# EAGLE design MQTT Monitor v2 (EAGLE 7.7.0)
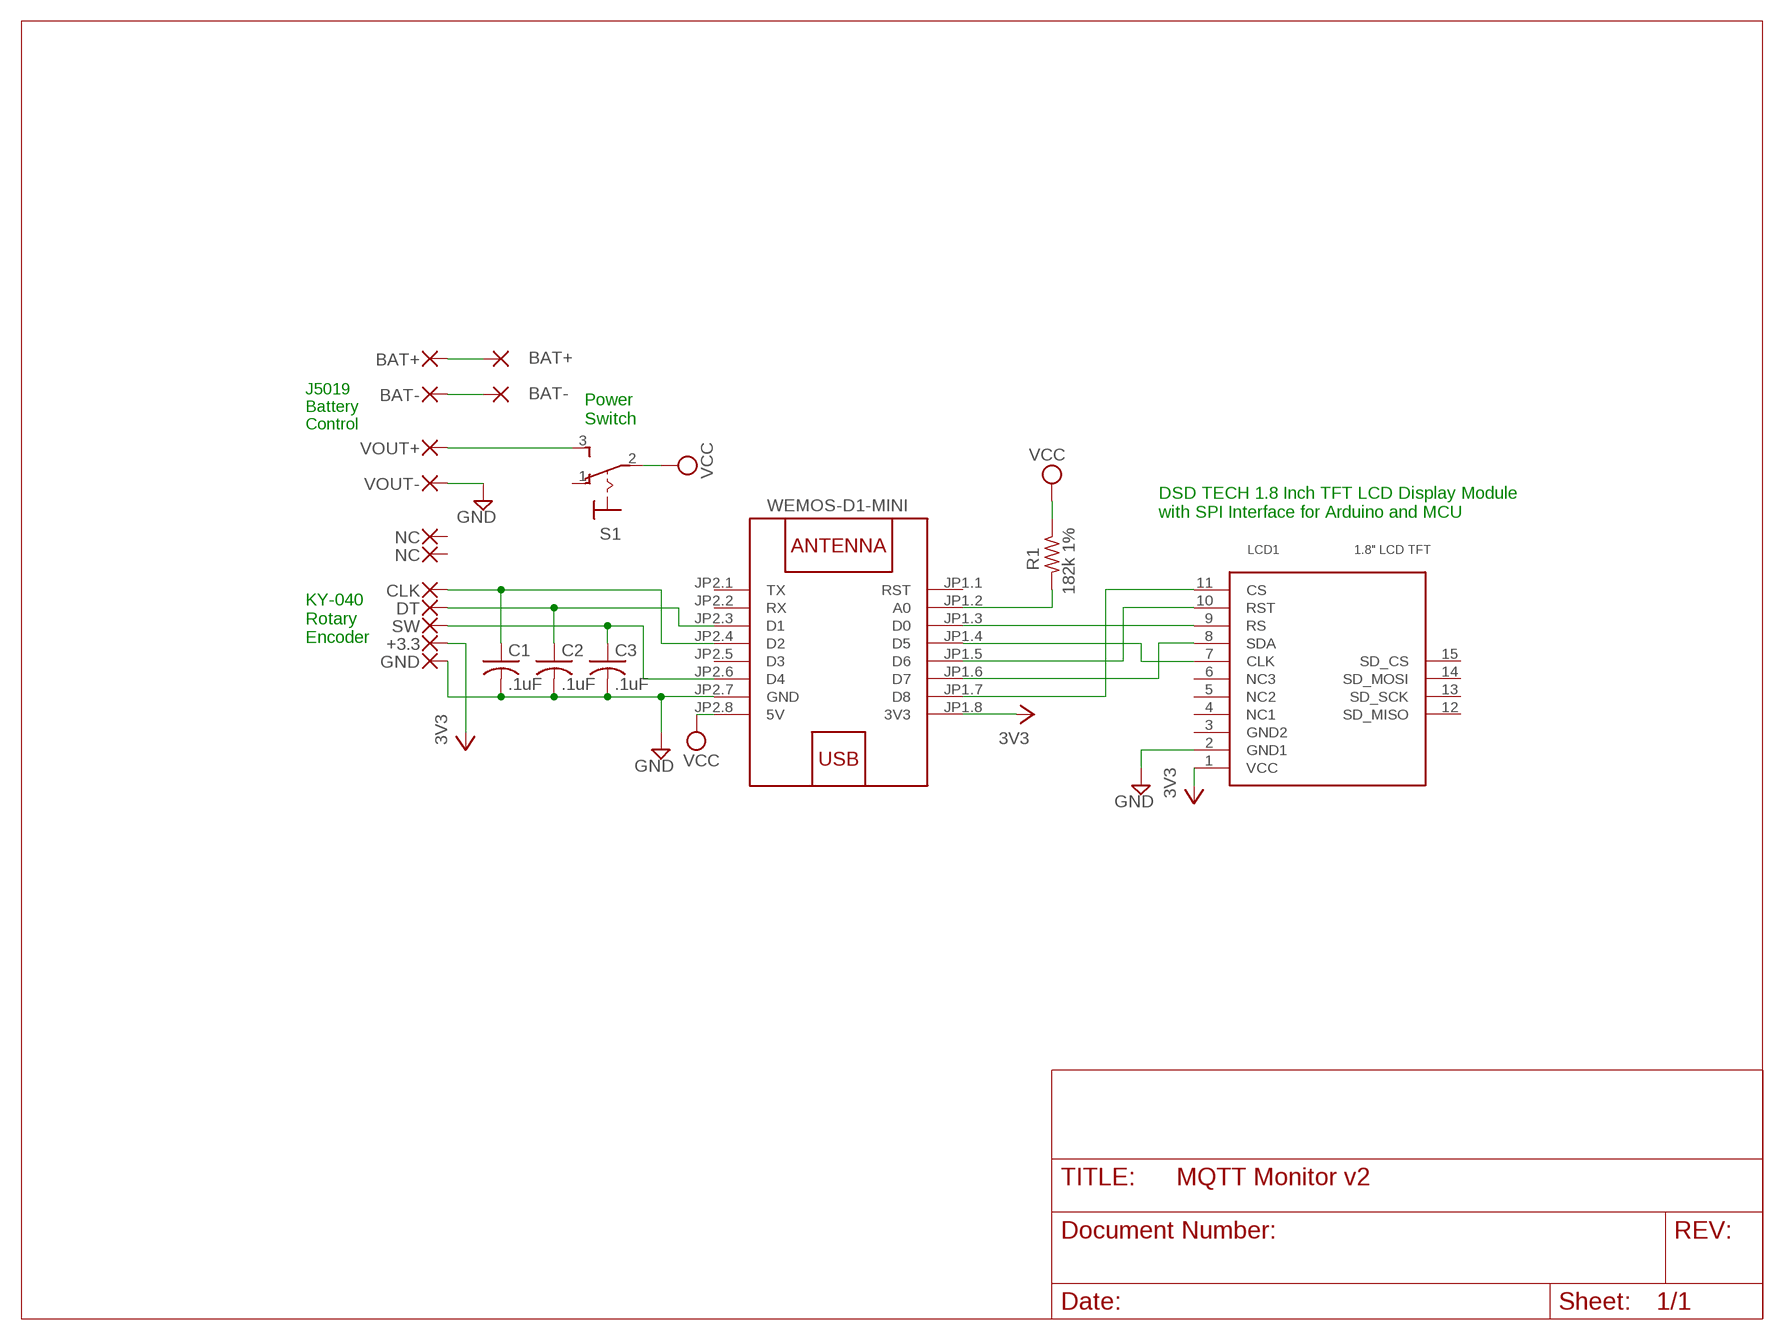
[diagram p0: schematic, sheet 1]

## Parts
C1  .1uF  C-USC1206  [C1206]
C2  .1uF  C-USC1206  [C1206]
C3  .1uF  C-USC1206  [C1206]
LCD1  1.8" LCD TFT  DSDTECH1.8"TFT  [DSDTECH1.8"TFT]
PAD1  CLK  2,15/1,0  [2,15/1,0]
PAD2  DT  2,15/1,0  [2,15/1,0]
PAD3  SW  2,15/1,0  [2,15/1,0]
PAD4  +3.3  2,15/1,0  [2,15/1,0]
PAD5  GND  2,15/1,0  [2,15/1,0]
PAD6  VOUT+  2,15/1,0  [2,15/1,0]
PAD7  VOUT-  2,15/1,0  [2,15/1,0]
PAD8  BAT+  2,15/1,0  [2,15/1,0]
PAD9  BAT-  2,15/1,0  [2,15/1,0]
PAD10  BAT+  2,15/1,0  [2,15/1,0]
PAD11  BAT-  2,15/1,0  [2,15/1,0]
PAD12  NC  2,15/1,0  [2,15/1,0]
PAD13  NC  2,15/1,0  [2,15/1,0]
R1  182k 1%  R-US_R1206  [R1206]
S1  320-916  [320-916]
U$1  WEMOS-D1-MINI  [WEMOS-D1-MINI]

## Nets
3V3: LCD1.1(VCC) PAD4.1(P) U$1.JP1.8(3V3)
5V: R1.1 S1.2(P) U$1.JP2.8(5V) ; supply symbol labelled VCC
GND: C1.2 C2.2 C3.2 LCD1.2(GND1) PAD5.1(P) PAD7.1(P) U$1.JP2.7(GND)
N$1: R1.2 U$1.JP1.2(A0)
N$2: C3.1 PAD3.1(P) U$1.JP2.6(D4)
N$3: LCD1.7(CLK) U$1.JP1.4(D5)
N$4: LCD1.8(SDA) U$1.JP1.6(D7)
N$5: LCD1.9(RS) U$1.JP1.3(D0)
N$6: LCD1.10(RST) U$1.JP1.5(D6)
N$7: LCD1.11(CS) U$1.JP1.7(D8)
N$8: PAD8.1(P) PAD10.1(P)
N$9: PAD9.1(P) PAD11.1(P)
N$10: C2.1 PAD2.1(P) U$1.JP2.3(D1)
N$11: C1.1 PAD1.1(P) U$1.JP2.4(D2)
N$12: PAD6.1(P) S1.3(S)
Unconnected: LCD1.3(GND2) LCD1.4(NC1) LCD1.5(NC2) LCD1.6(NC3) LCD1.12(SD_MISO) LCD1.13(SD_SCK) LCD1.14(SD_MOSI) LCD1.15(SD_CS) PAD12.1(P) PAD13.1(P) S1.1(O) U$1.JP1.1(RST) U$1.JP2.1(TX) U$1.JP2.2(RX) U$1.JP2.5(D3)

## Notes on the sheet
- Power
  Switch
- J5019
  Battery
  Control
- DSD TECH 1.8 Inch TFT LCD Display Module
  with SPI Interface for Arduino and MCU
- KY-040
  Rotary
  Encoder

## Library data of the parts
C1-C3 = rcl:C-US: CAPACITOR, American symbol
LCD1 = tft_1.8_1.44_oled_0.96:DSDTECH1.8"TFT
PAD1-PAD13 = wirepad:2,15/1,0: THROUGH-HOLE PAD
R1 = rcl:R-US_: RESISTOR, American symbol
S1 = switch:320-916: TOGGLE SWITCH distributor RS Components
U$1 = diy-modules:WEMOS-D1-MINI: WEMOS D1 mini: Mini Wi-Fi Board based on ESP-8266 device More details can be found here: https://www.wemos.cc/product/d1-mini.html Click here to find device on ebay.com <http://www.ebay.com/sch/wemos+d1+mini+nodemcu>

## Board
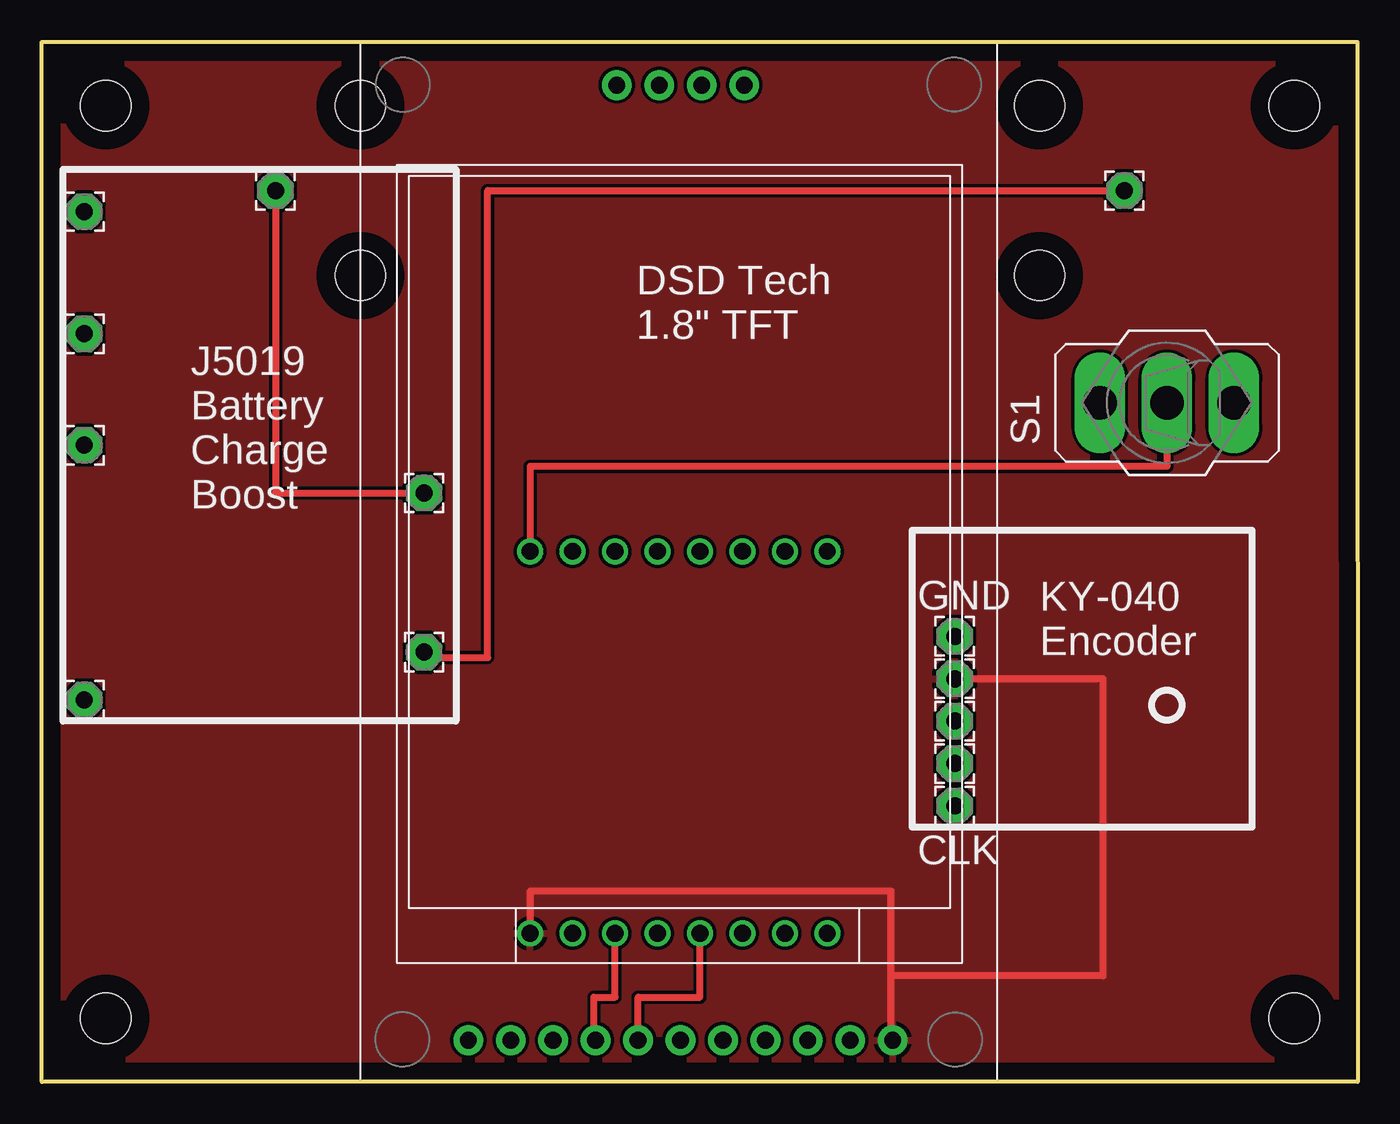
[diagram p1: board, top side]
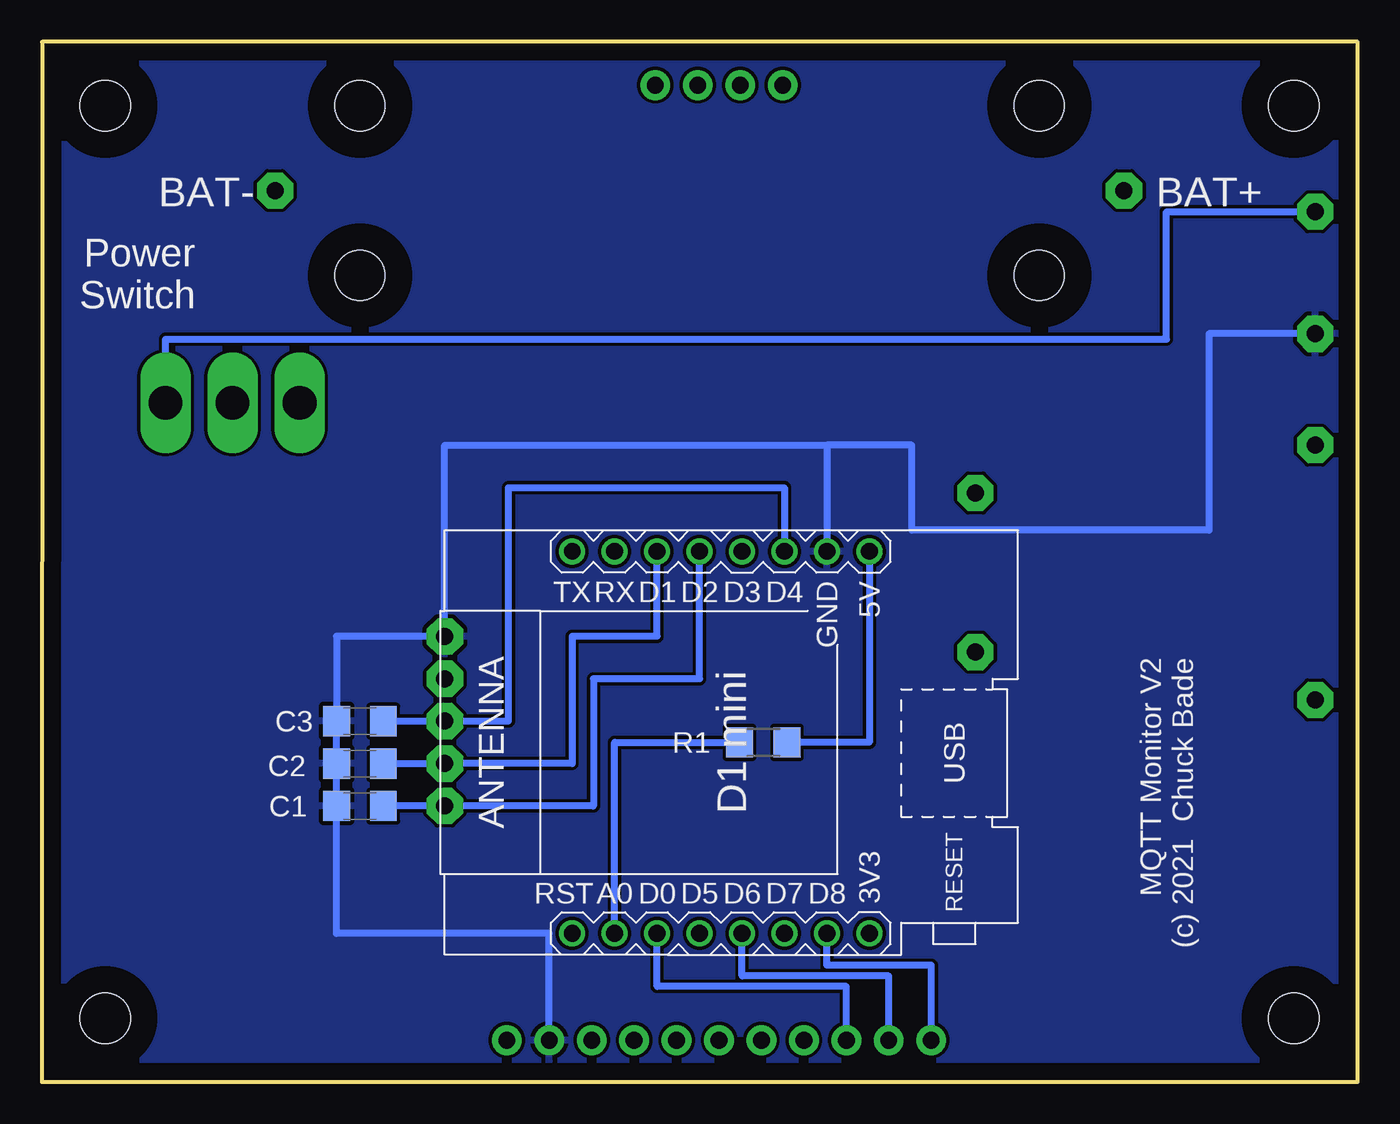
[diagram p2: board, bottom side, seen from below]

Size 78.74 x 62.24 mm. Coordinates in mm from the lower left corner, seen from the top.
Outline: 0.01,62.23 78.71,62.24 78.74,0 0,0 0.01,62.23
Copper layers (1*16): Top 0.035mm / dielectric 1.5mm / Bottom 0.035mm
Design rules "default *": minimum track width 10mil, minimum drill 10mil, track to track 8mil, track to pad 8mil, pad to pad 8mil, via to via 8mil, smd to smd 8mil, copper to edge 40mil, drill to drill 8mil, minimum pad ring 11mil, minimum via ring 8mil, stop-mask expansion 4mil, vias tented up to drill 0mil, thermal gap 10mil

### Footprints (pad centres in the part's own frame; a part is rotated, then mirrored left to right if it is on the bottom)
C1206 = smd 1.6 x 1.8: 1 -1.4,0; 2 1.4,0
DSDTECH1.8"TFT = drill 1 pad 1.778: 1 2.5,6.245; 2 2.5,8.785; 3 2.5,11.325; 4 2.5,13.865; 5 2.5,16.405; 6 2.5,18.945; 7 2.5,21.485; 8 2.5,24.025; 9 2.5,26.565; 10 2.5,29.105; 11 2.5,31.645; 12 59.65,15.135; 13 59.65,17.675; 14 59.65,20.215; 15 59.65,22.755
2,15/1,0 = drill 1.016 pad 2.159 octagon: 1 0,0
R1206 = smd 1.6 x 1.803: 1 -1.422,0; 2 1.422,0
320-916 = drill 2.007 long: 1 0,4.013; 2 0,0; 3 0,-4.013
WEMOS-D1-MINI = drill 1: JP1.1 -11.43,9.525; JP1.2 -11.43,6.985; JP1.3 -11.43,4.445; JP1.4 -11.43,1.905; JP1.5 -11.43,-0.635; JP1.6 -11.43,-3.175; JP1.7 -11.43,-5.715; JP1.8 -11.43,-8.255; JP2.1 11.43,9.525; JP2.2 11.43,6.985; JP2.3 11.43,4.445; JP2.4 11.43,1.905; JP2.5 11.43,-0.635; JP2.6 11.43,-3.175; JP2.7 11.43,-5.715; JP2.8 11.43,-8.255
4-40SCREW = hole 2.997: 0,0

### Placement (x,y rotation side)
C1  59.7,16.51 180 bottom
C2  59.7,19.05 180 bottom
C3  59.7,21.59 180 bottom
LCD1  57.16,0 90 top
PAD1  54.62,16.51 0 top
PAD2  54.62,19.05 0 top
PAD3  54.62,21.59 0 top
PAD4  54.62,24.13 0 top
PAD5  54.62,26.67 0 top
PAD6  2.55,52.07 0 top
PAD7  2.55,44.76 0 top
PAD8  22.87,35.24 0 top
PAD9  22.87,25.71 0 top
PAD10  13.98,53.34 0 top
PAD11  64.78,53.34 0 top
PAD12  2.55,38.1 0 top
PAD13  2.55,22.86 0 top
R1  35.57,20.32 180 bottom
S1  67.32,40.64 90 top
U$1  37.48,20.32 90 bottom
U$3  [4-40SCREW]  3.82,58.42 180 bottom
U$4  [4-40SCREW]  74.94,3.81 180 bottom
U$5  [4-40SCREW]  74.94,58.42 180 bottom
U$6  [4-40SCREW]  3.82,3.81 180 bottom
U$7  [4-40SCREW]  19.06,58.42 180 bottom
U$8  [4-40SCREW]  59.7,58.42 180 bottom
U$9  [4-40SCREW]  59.7,48.26 180 bottom
U$10  [4-40SCREW]  19.06,48.26 180 bottom

### Tracks (layer width: path | path; a pad name or v marks a point on that pad's centre or on a via)
3V3
  Top 0.406: LCD1.1 50.81,2.6 50.81,6.35 | 50.81,6.35 50.81,11.43 29.22,11.43 U$1.JP1.8 | 50.81,6.35 63.51,6.35 63.51,24.13 PAD4.1
  pour Top: -2.53,64.77 81.29,64.77 81.29,-2.54 -2.53,-2.54
5V
  Top 0.406: S1.2 67.32,36.83 29.22,36.83 U$1.JP2.8
  Bottom 0.406: U$1.JP2.8 29.22,20.32 R1.1
GND
  Bottom 0.406: LCD1.2 48.38,8.89 61.1,8.89 C1.2 C2.2 C3.2 61.1,26.67 PAD5.1 54.62,38.1 31.76,38.1 | 31.76,38.1 U$1.JP2.7 | PAD7.1 8.9,44.76 8.9,33.02 26.68,33.02 26.68,38.1 31.76,38.1
  pour Bottom: -1.26,63.5 80.02,63.5 80.02,-1.27 -1.26,-1.27
N$1
  Bottom 0.406: U$1.JP1.2 44.46,20.32 R1.2
N$2
  Bottom 0.406: C3.1 PAD3.1 50.81,21.59 50.81,35.56 34.3,35.56 U$1.JP2.6
N$3
  Top 0.406: LCD1.7 35.68,5.08 39.38,5.08 U$1.JP1.4
N$4
  Top 0.406: LCD1.8 33.03,2.5 33.03,5.08 34.3,5.08 U$1.JP1.6
N$5
  Bottom 0.406: LCD1.9 30.6,5.71 41.92,5.71 U$1.JP1.3
N$6
  Bottom 0.406: LCD1.10 28.06,6.35 36.84,6.35 U$1.JP1.5
N$7
  Bottom 0.406: LCD1.11 25.52,6.98 31.76,6.98 U$1.JP1.7
N$8
  Top 0.406: PAD10.1 13.98,35.24 PAD8.1
N$9
  Top 0.406: PAD9.1 22.87,25.4 26.68,25.4 26.68,53.34 PAD11.1
N$10
  Bottom 0.406: C2.1 PAD2.1 47,19.05 47,26.67 41.92,26.67 U$1.JP2.3
N$11
  Bottom 0.406: C1.1 PAD1.1 45.73,16.51 45.73,24.13 39.38,24.13 U$1.JP2.4
N$12
  Bottom 0.406: S1.3 71.33,44.45 11.44,44.45 11.44,52.07 PAD6.1

### Text on the board
Dimension: C1-C3 .1uf / R1 182K
bPlace: MQTT Monitor V2 / (c) 2021 Chuck Bade
tNames: DSD Tech / 1.8" TFT | J5019 / Battery / Charge / Boost | GND | KY-040 / Encoder | CLK
bNames: BAT+ | BAT- | Power / Switch